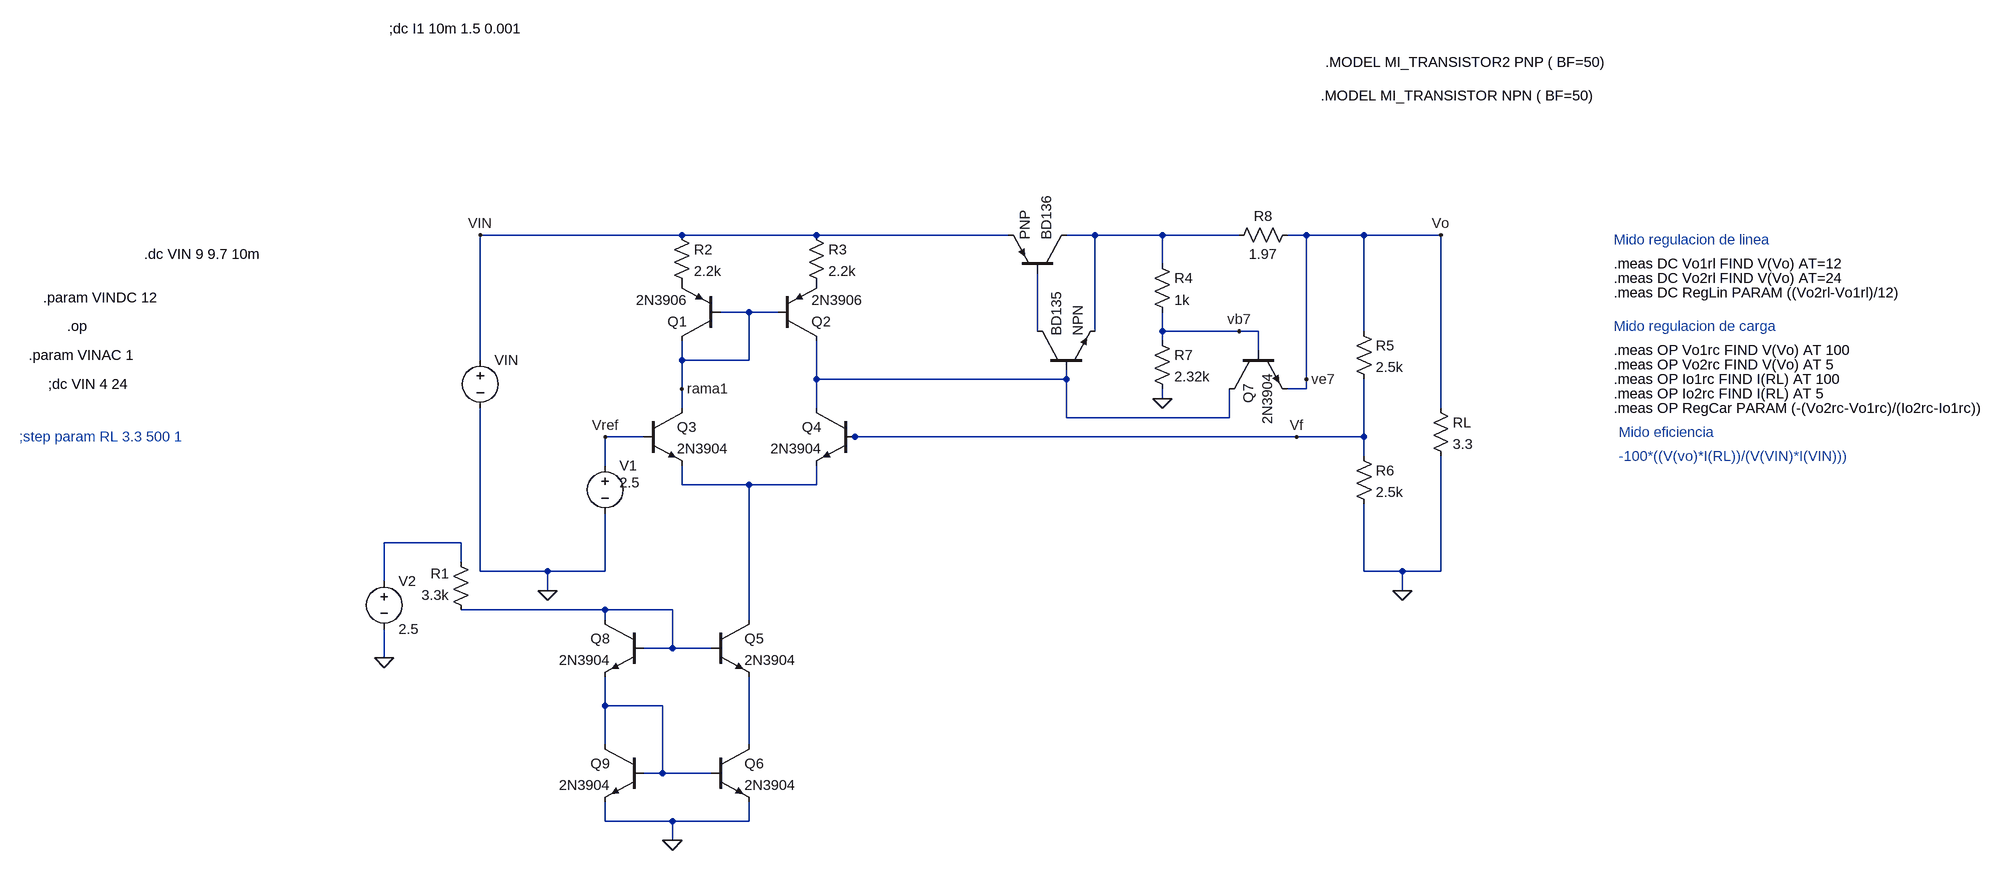
[diagram p0: schematic con_lazo_corriente.asc]
con_lazo_corriente.asc, the LTspice schematic file:
Version 4
SHEET 1 2316 996
WIRE 96 -32 -240 -32
WIRE 320 -32 96 -32
WIRE 640 -32 320 -32
WIRE 784 -32 736 -32
WIRE 896 -32 784 -32
WIRE 1024 -32 896 -32
WIRE 1136 -32 1104 -32
WIRE 1232 -32 1136 -32
WIRE 1360 -32 1232 -32
WIRE 896 16 896 -32
WIRE 208 96 160 96
WIRE 256 96 208 96
WIRE 688 128 688 32
WIRE 784 128 784 -32
WIRE 896 128 896 96
WIRE 1024 128 896 128
WIRE 1056 128 1024 128
WIRE 1232 128 1232 -32
WIRE 896 144 896 128
WIRE 1056 160 1056 128
WIRE -240 176 -240 -32
WIRE 96 176 96 144
WIRE 208 176 208 96
WIRE 208 176 96 176
WIRE 320 208 320 144
WIRE 736 208 736 192
WIRE 736 208 320 208
WIRE 1136 208 1136 -32
WIRE 96 224 96 176
WIRE 1136 224 1136 208
WIRE 1136 224 1104 224
WIRE 896 240 896 224
WIRE 96 256 96 224
WIRE 320 256 320 208
WIRE 1360 256 1360 -32
WIRE 736 272 736 208
WIRE 1008 272 1008 224
WIRE 1008 272 736 272
WIRE 32 304 -32 304
WIRE 384 304 368 304
WIRE 1120 304 384 304
WIRE 1232 304 1232 208
WIRE 1232 304 1120 304
WIRE 1232 336 1232 304
WIRE -32 352 -32 304
WIRE 96 384 96 352
WIRE 208 384 96 384
WIRE 320 384 320 352
WIRE 320 384 208 384
WIRE -272 480 -400 480
WIRE -272 512 -272 480
WIRE -240 528 -240 256
WIRE -128 528 -240 528
WIRE -32 528 -32 432
WIRE -32 528 -128 528
WIRE 1232 528 1232 416
WIRE 1296 528 1232 528
WIRE 1360 528 1360 336
WIRE 1360 528 1296 528
WIRE -400 544 -400 480
WIRE -128 560 -128 528
WIRE 1296 560 1296 528
WIRE -32 592 -272 592
WIRE 80 592 -32 592
WIRE -32 608 -32 592
WIRE 208 608 208 384
WIRE 80 656 80 592
WIRE 80 656 32 656
WIRE 144 656 80 656
WIRE -400 672 -400 624
WIRE -32 752 -32 704
WIRE 64 752 -32 752
WIRE -32 816 -32 752
WIRE 208 816 208 704
WIRE 64 864 64 752
WIRE 64 864 32 864
WIRE 144 864 64 864
WIRE -32 944 -32 912
WIRE 80 944 -32 944
WIRE 208 944 208 912
WIRE 208 944 80 944
WIRE 80 976 80 944
FLAG 1360 -32 Vo
FLAG -32 304 Vref
FLAG -240 -32 VIN
FLAG 1120 304 Vf
FLAG 896 240 0
FLAG 96 224 rama1
FLAG 1024 128 vb7
FLAG 1136 208 ve7
FLAG 80 976 0
FLAG -128 560 0
FLAG 1296 560 0
FLAG -400 672 0
DATAFLAG 208 384 ""
DATAFLAG 80 640 ""
DATAFLAG -64 592 ""
SYMBOL pnp 160 144 R180
SYMATTR InstName Q1
SYMATTR Value 2N3906
SYMBOL pnp 256 144 M180
SYMATTR InstName Q2
SYMATTR Value 2N3906
SYMBOL npn 32 256 R0
SYMATTR InstName Q3
SYMATTR Value 2N3904
SYMBOL npn 384 256 M0
SYMATTR InstName Q4
SYMATTR Value 2N3904
SYMBOL pnp 736 32 M270
SYMATTR InstName BD136
SYMBOL res 1216 112 R0
SYMATTR InstName R5
SYMATTR Value 2.5k
SYMBOL res 1216 320 R0
SYMATTR InstName R6
SYMATTR Value 2.5k
SYMBOL voltage -32 336 R0
WINDOW 123 24 124 Left 2
WINDOW 39 0 0 Left 0
WINDOW 3 24 44 Left 2
SYMATTR Value 2.5
SYMATTR InstName V1
SYMBOL voltage -240 160 R0
WINDOW 123 24 124 Left 2
WINDOW 39 0 0 Left 0
WINDOW 3 24 44 Left 2
SYMATTR Value ""
SYMATTR InstName VIN
SYMBOL res 80 -48 R0
SYMATTR InstName R2
SYMATTR Value 2.2k
SYMBOL res 304 -48 R0
SYMATTR InstName R3
SYMATTR Value 2.2k
SYMBOL res 880 0 R0
SYMATTR InstName R4
SYMATTR Value 1k
SYMBOL res 880 128 R0
SYMATTR InstName R7
SYMATTR Value 2.32k
SYMBOL res 1120 -48 R90
WINDOW 0 0 56 VBottom 2
WINDOW 3 32 56 VTop 2
SYMATTR InstName R8
SYMATTR Value 1.97
SYMBOL npn 1008 160 M90
WINDOW 3 39 64 Left 2
SYMATTR Value 2N3904
SYMATTR InstName Q7
SYMBOL npn 688 192 R270
SYMATTR InstName BD135
SYMBOL npn 144 608 R0
SYMATTR InstName Q5
SYMATTR Value 2N3904
SYMBOL npn 144 816 R0
SYMATTR InstName Q6
SYMATTR Value 2N3904
SYMBOL npn 32 608 M0
SYMATTR InstName Q8
SYMATTR Value 2N3904
SYMBOL npn 32 816 M0
SYMATTR InstName Q9
SYMATTR Value 2N3904
SYMBOL res -256 608 R180
WINDOW 0 36 76 Left 2
WINDOW 3 36 40 Left 2
SYMATTR InstName R1
SYMATTR Value 3.3k
SYMBOL voltage -400 528 R0
WINDOW 123 0 0 Left 0
WINDOW 39 0 0 Left 0
SYMATTR InstName V2
SYMATTR Value 2.5
SYMBOL res 1344 240 R0
SYMATTR InstName RL
SYMATTR Value 3.3
TEXT -928 120 Left 2 !.op
TEXT -968 72 Left 2 !.param VINDC 12
TEXT -992 168 Left 2 !.param VINAC 1
TEXT -960 216 Left 2 !;dc VIN 4 24
TEXT -1008 304 Left 2 ;;step param RL 3.3 500 1
TEXT 1648 -24 Left 2 ;Mido regulacion de linea
TEXT 1648 16 Left 2 !.meas DC Vo1rl FIND V(Vo) AT=12
TEXT 1648 40 Left 2 !.meas DC Vo2rl FIND V(Vo) AT=24
TEXT 1648 64 Left 2 !.meas DC RegLin PARAM ((Vo2rl-Vo1rl)/12)
TEXT 1648 120 Left 2 ;Mido regulacion de carga
TEXT 1648 160 Left 2 !.meas OP Vo1rc FIND V(Vo) AT 100
TEXT 1648 184 Left 2 !.meas OP Vo2rc FIND V(Vo) AT 5
TEXT 1648 208 Left 2 !.meas OP Io1rc FIND I(RL) AT 100
TEXT 1648 232 Left 2 !.meas OP Io2rc FIND I(RL) AT 5
TEXT 1656 296 Left 2 ;Mido eficiencia
TEXT 1656 336 Left 2 ;-100*((V(vo)*I(RL))/(V(VIN)*I(VIN)))
TEXT 1648 256 Left 2 !.meas OP RegCar PARAM (-(Vo2rc-Vo1rc)/(Io2rc-Io1rc))
TEXT 1160 -264 Left 2 !.MODEL MI_TRANSISTOR NPN ( BF=50)
TEXT 1168 -320 Left 2 !.MODEL MI_TRANSISTOR2 PNP ( BF=50)
TEXT -392 -376 Left 2 !;dc I1 10m 1.5 0.001
TEXT -800 0 Left 2 !.dc VIN 9 9.7 10m

The netlist it stands for:
* con_lazo_corriente.asc
Q1 rama1 rama1 P001 0 2N3906
Q2 N003 rama1 P002 0 2N3906
Q3 rama1 Vref N004 0 2N3904
Q4 N003 Vf N004 0 2N3904
Q§BD136 N001 N002 VIN 0 PNP
R5 ve7 Vf 2.5k
R6 Vf 0 2.5k
V1 Vref 0 2.5
VIN VIN 0
R2 VIN P001 2.2k
R3 VIN P002 2.2k
R4 N001 vb7 1k
R7 vb7 0 2.32k
R8 ve7 N001 1.97
Q7 N003 vb7 ve7 0 2N3904
Q§BD135 N002 N003 N001 0 NPN
Q5 N004 N006 N008 0 2N3904
Q6 N008 N007 0 0 2N3904
Q8 N006 N006 N007 0 2N3904
Q9 N007 N007 0 0 2N3904
R1 N006 N005 3.3k
V2 N005 0 2.5
RL ve7 0 3.3
.model NPN NPN
.model PNP PNP
.lib standard.bjt
.op
.param VINDC 12
.param VINAC 1
;dc VIN 4 24
* ;step param RL 3.3 500 1
* Mido regulacion de linea
.meas DC Vo1rl FIND V(Vo) AT=12
.meas DC Vo2rl FIND V(Vo) AT=24
.meas DC RegLin PARAM ((Vo2rl-Vo1rl)/12)
* Mido regulacion de carga
.meas OP Vo1rc FIND V(Vo) AT 100
.meas OP Vo2rc FIND V(Vo) AT 5
.meas OP Io1rc FIND I(RL) AT 100
.meas OP Io2rc FIND I(RL) AT 5
* Mido eficiencia
* -100*((V(vo)*I(RL))/(V(VIN)*I(VIN)))
.meas OP RegCar PARAM (-(Vo2rc-Vo1rc)/(Io2rc-Io1rc))
.MODEL MI_TRANSISTOR NPN ( BF=50)
.MODEL MI_TRANSISTOR2 PNP ( BF=50)
;dc I1 10m 1.5 0.001
.dc VIN 9 9.7 10m
.backanno
.end